# Altium schematic sheet sensor-hum-temp.SchDoc
size A3; DocumentNumber: 38; SheetNumber: 38; SheetTotal: 45; SheetDescription: Humidity and Temperature Sensor
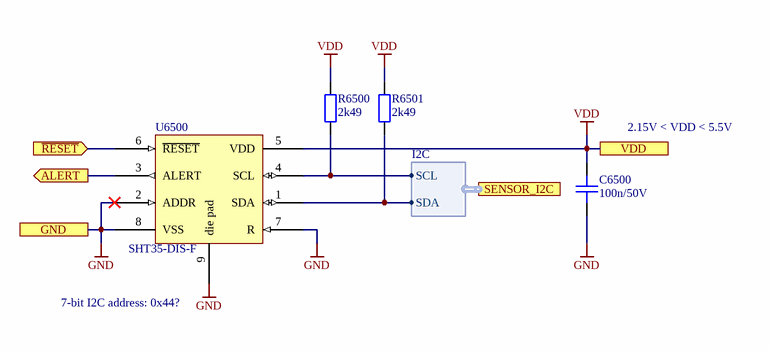
[diagram p0: sensor-hum-temp.SchDoc]

## Parts
C6500  100n/50V  [CAPC1005X06N]
R6500  2k49  [RESC1005X04N]
R6501  2k49  [RESC1005X04N]
U6500  SHT35-DIS-F  [SHT3X]

## Ports
ALERT (out), GND, SENSOR_I2C (harness I2C), VDD, ~{RESET} (in)

## Harnesses
I2C: SDA, SCL

## Nets
GND: C6500.1 U6500.2(ADDR) U6500.7(R) U6500.8(VSS) U6500.9(die_pad) ; port GND
VDD: C6500.2 R6500.2 R6501.2 U6500.5(VDD) ; port VDD
~{RESET}: U6500.6(~{RESET}) ; port ~{RESET}
ALERT: U6500.3(ALERT) ; port ALERT
NetR6500_1: R6500.1 U6500.4(SCL) ; port SENSOR_I2C.SCL
NetR6501_1: R6501.1 U6500.1(SDA) ; port SENSOR_I2C.SDA

## Notes on the sheet
- 2.15V < VDD < 5.5V
- 7-bit I2C address: 0x44?
- Fraunhofer IISB
- Schottkystr. 10
- developed by:
- 91058 Erlangen
- Germany
- Author
- Project
- License
- Description
- File
- Version
- Release Date
- Sheet
- foxbms.org <https://foxbms.org>
- www.iisb.fraunhofer.de <https://www.iisb.fraunhofer.de/>
- foxBMS Team
- /

## Library data of the parts
C6500 = gen_C_ceramic_100n_50V_X7R_0402: MLCC; Capacitance: 100n; Rated Voltage: 50V; Dielectric: X7R; Case EIA: 0402; Case Metric: 1005; PnP Package: 0402C; PnP Value: 100nF/50V/X7R; PnP equipped: x; Automotive Qualified: True; AEC-Q Norm: AEC-Q200; Part Number: gen_C_ceramic_100n_50V_X7R_0402; Supplier 1: Farnell; Supplier Part Number 1: 2210822; ECCN: EAR99
R6500 R6501 = gen_R_2k49_0402: SMD Resistor 2k49 0402; Tolerance: 1%; Power: 0.063W; Case EIA: 0402; Case Metric: 1005; Maximum Working Voltage: 50V; PnP Package: 0402R; Automotive Qualified: True; Part Number: gen_R_2k49_0402; Operating Temperature: -55°C - +155°C; Resistance: 2k49; Series: E96; PnP Value: 2k49; Supplier 1: Farnell; Supplier Part Number 1: 2059135
U6500 = SHT35-DIS-F: Humidity/Temp Sensor, Digital, Dfn-8; Manufacturer: Sensirion; PnP Package: DFN; Automotive Qualified: True; Part Number: SHT35-DIS-F; Part Name: SHT35-DIS-F; Operating Temperature: -40°C - +125°C; ComponentLink1Description: Datasheet; ComponentLink1URL: http://www.farnell.com/datasheets/2756487.pdf; Supplier 1: Farnell; Supplier Part Number 1: 2886656; Supplier 2: Digikey; Supplier Part Number 2: 1649-1067-1-ND; Supplier 3: Mouser; Supplier Part Number 3: 403-SHT35-DIS-F